# Altium schematic sheet B35.SchDoc: ZoM Mod A - FPGA Bank 35
size A4; Organization: Trenz Electronic GmbH / TT; DocumentNumber: 8; Revision: 01; SheetNumber: 8; SheetTotal: 13; Date: 12/16/2014
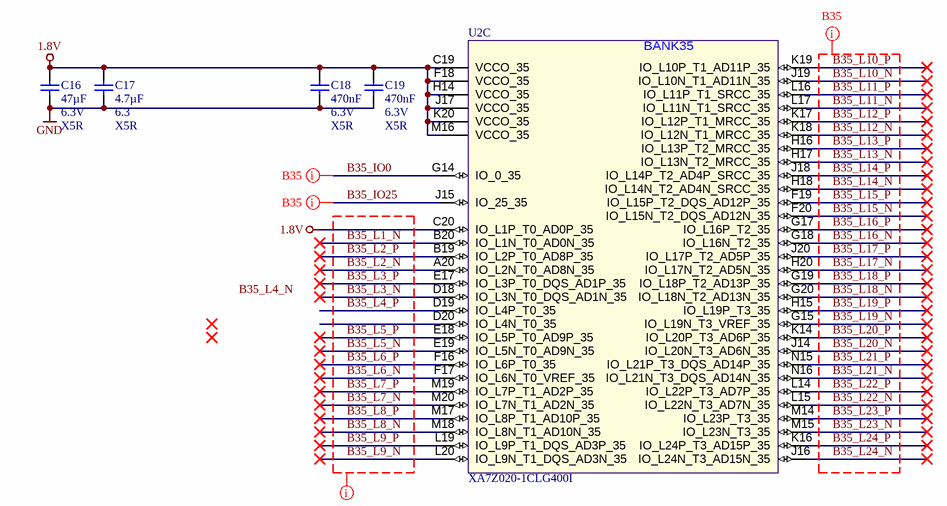
[diagram p0: B35.SchDoc]

## Parts
C16  47µF  Voltage: 6.3V  Technology: X5R  [CAPC3216X180N]
C17  4.7µF  Voltage: 6.3  Technology: X5R  [CAPC1005X60N]
C18  470nF  Voltage: 6.3V  Technology: X5R  [CAPC0603X33N]
C19  470nF  Voltage: 6.3V  Technology: X5R  [CAPC0603X33N]
U2  XA7Z020-1CLG400I  [BGA400C80P20X20_1700X1700X160N]  (part C of 8)

## Nets
1.8V: C16.1 C17.1 C18.1 C19.1 U2.C19(VCCO_35) U2.C20(IO_L1P_T0_AD0P_35) U2.F18(VCCO_35) U2.H14(VCCO_35) U2.J17(VCCO_35) U2.K20(VCCO_35) U2.M16(VCCO_35)
GND: C16.2 C17.2 C18.2 C19.2
B35_IO0: U2.G14(IO_0_35)
B35_IO25: U2.J15(IO_25_35)
B35_L1_N: U2.B20(IO_L1N_T0_AD0N_35)
B35_L2_N: U2.A20(IO_L2N_T0_AD8N_35)
B35_L2_P: U2.B19(IO_L2P_T0_AD8P_35)
B35_L3_N: U2.D18(IO_L3N_T0_DQS_AD1N_35)
B35_L3_P: U2.E17(IO_L3P_T0_DQS_AD1P_35)
B35_L4_P: U2.D19(IO_L4P_T0_35)
B35_L5_N: U2.E19(IO_L5N_T0_AD9N_35)
B35_L5_P: U2.E18(IO_L5P_T0_AD9P_35)
B35_L6_N: U2.F17(IO_L6N_T0_VREF_35)
B35_L6_P: U2.F16(IO_L6P_T0_35)
B35_L7_N: U2.M20(IO_L7N_T1_AD2N_35)
B35_L7_P: U2.M19(IO_L7P_T1_AD2P_35)
B35_L8_N: U2.M18(IO_L8N_T1_AD10N_35)
B35_L8_P: U2.M17(IO_L8P_T1_AD10P_35)
B35_L9_N: U2.L20(IO_L9N_T1_DQS_AD3N_35)
B35_L9_P: U2.L19(IO_L9P_T1_DQS_AD3P_35)
B35_L10_N: U2.J19(IO_L10N_T1_AD11N_35)
B35_L10_P: U2.K19(IO_L10P_T1_AD11P_35)
B35_L11_N: U2.L17(IO_L11N_T1_SRCC_35)
B35_L11_P: U2.L16(IO_L11P_T1_SRCC_35)
B35_L12_N: U2.K18(IO_L12N_T1_MRCC_35)
B35_L12_P: U2.K17(IO_L12P_T1_MRCC_35)
B35_L13_N: U2.H17(IO_L13N_T2_MRCC_35)
B35_L13_P: U2.H16(IO_L13P_T2_MRCC_35)
B35_L14_N: U2.H18(IO_L14N_T2_AD4N_SRCC_35)
B35_L14_P: U2.J18(IO_L14P_T2_AD4P_SRCC_35)
B35_L15_N: U2.F20(IO_L15N_T2_DQS_AD12N_35)
B35_L15_P: U2.F19(IO_L15P_T2_DQS_AD12P_35)
B35_L16_N: U2.G18(IO_L16N_T2_35)
B35_L16_P: U2.G17(IO_L16P_T2_35)
B35_L17_N: U2.H20(IO_L17N_T2_AD5N_35)
B35_L17_P: U2.J20(IO_L17P_T2_AD5P_35)
B35_L18_N: U2.G20(IO_L18N_T2_AD13N_35)
B35_L18_P: U2.G19(IO_L18P_T2_AD13P_35)
B35_L19_N: U2.G15(IO_L19N_T3_VREF_35)
B35_L19_P: U2.H15(IO_L19P_T3_35)
B35_L20_N: U2.J14(IO_L20N_T3_AD6N_35)
B35_L20_P: U2.K14(IO_L20P_T3_AD6P_35)
B35_L21_N: U2.N16(IO_L21N_T3_DQS_AD14N_35)
B35_L21_P: U2.N15(IO_L21P_T3_DQS_AD14P_35)
B35_L22_N: U2.L15(IO_L22N_T3_AD7N_35)
B35_L22_P: U2.L14(IO_L22P_T3_AD7P_35)
B35_L23_N: U2.M15(IO_L23N_T3_35)
B35_L23_P: U2.M14(IO_L23P_T3_35)
B35_L24_N: U2.J16(IO_L24N_T3_AD15N_35)
B35_L24_P: U2.K16(IO_L24P_T3_AD15P_35)

Not connected (* = marked no-connect by the designer): U2 D20(IO_L4N_T0_35)

## Layout directives
net class B35: B35_IO0, B35_IO25, B35_L1_N, B35_L2_N, B35_L2_P, B35_L3_N, B35_L3_P, B35_L4_P, B35_L5_N, B35_L5_P, B35_L6_N, B35_L6_P, B35_L7_N, B35_L7_P, B35_L8_N, B35_L8_P, B35_L9_N, B35_L9_P, B35_L10_N, B35_L10_P, B35_L11_N, B35_L11_P, B35_L12_N, B35_L12_P, B35_L13_N, B35_L13_P, B35_L14_N, B35_L14_P, B35_L15_N, B35_L15_P, B35_L16_N, B35_L16_P, B35_L17_N, B35_L17_P, B35_L18_N, B35_L18_P, B35_L19_N, B35_L19_P, B35_L20_N, B35_L20_P, B35_L21_N, B35_L21_P, B35_L22_N, B35_L22_P, B35_L23_N, B35_L23_P, B35_L24_N, B35_L24_P

## Notes on the sheet
- Labels drawn without touching a wire or pin: B35_L4_N
- Title:
- Nummer:
- Rev.
- Datum:
- A4
- Zeichner:
- Blatt
- von
- Filename:
- (in symbol 25981, part C) BANK35

## Library data of the parts
C16 = 24557: KON 47µF 6.3V  X5R SMD 20%; AN: 24557; Mixed: SMT; Value: 47u; Preferred: Yes; Case: 3216 (1206); Tolerance: 20%
C17 = 24719: KON 4.7µF 6.3V X5R SMD; AN: 24719; Value: 4.7u; Mixed: SMT; Preferred: Yes; Case: 1005 (0402)
C18 C19 = 24921: KON 470nF X5R 6.3V SMD; AN: 24921; Value: 470n; Tolerance: 20%; Mixed: SMT; Preferred: Yes; Case: 0603 (0201)
U2 = 25981: AN: 25981; Mixed: SMT; Trenz-Stock: Yes; Case: CLG400; HelpURL: B:\AD\adlib\datasheet\XC7